# EasyEDA schematic SCH_CorvetteALDL_2024-03-12.json
TITLE: Corvette C4 ALDL; REV: 1.0; Date: 2023-11-16; Sheet: 1/1; Drawn By: cubus; Company: Cubus
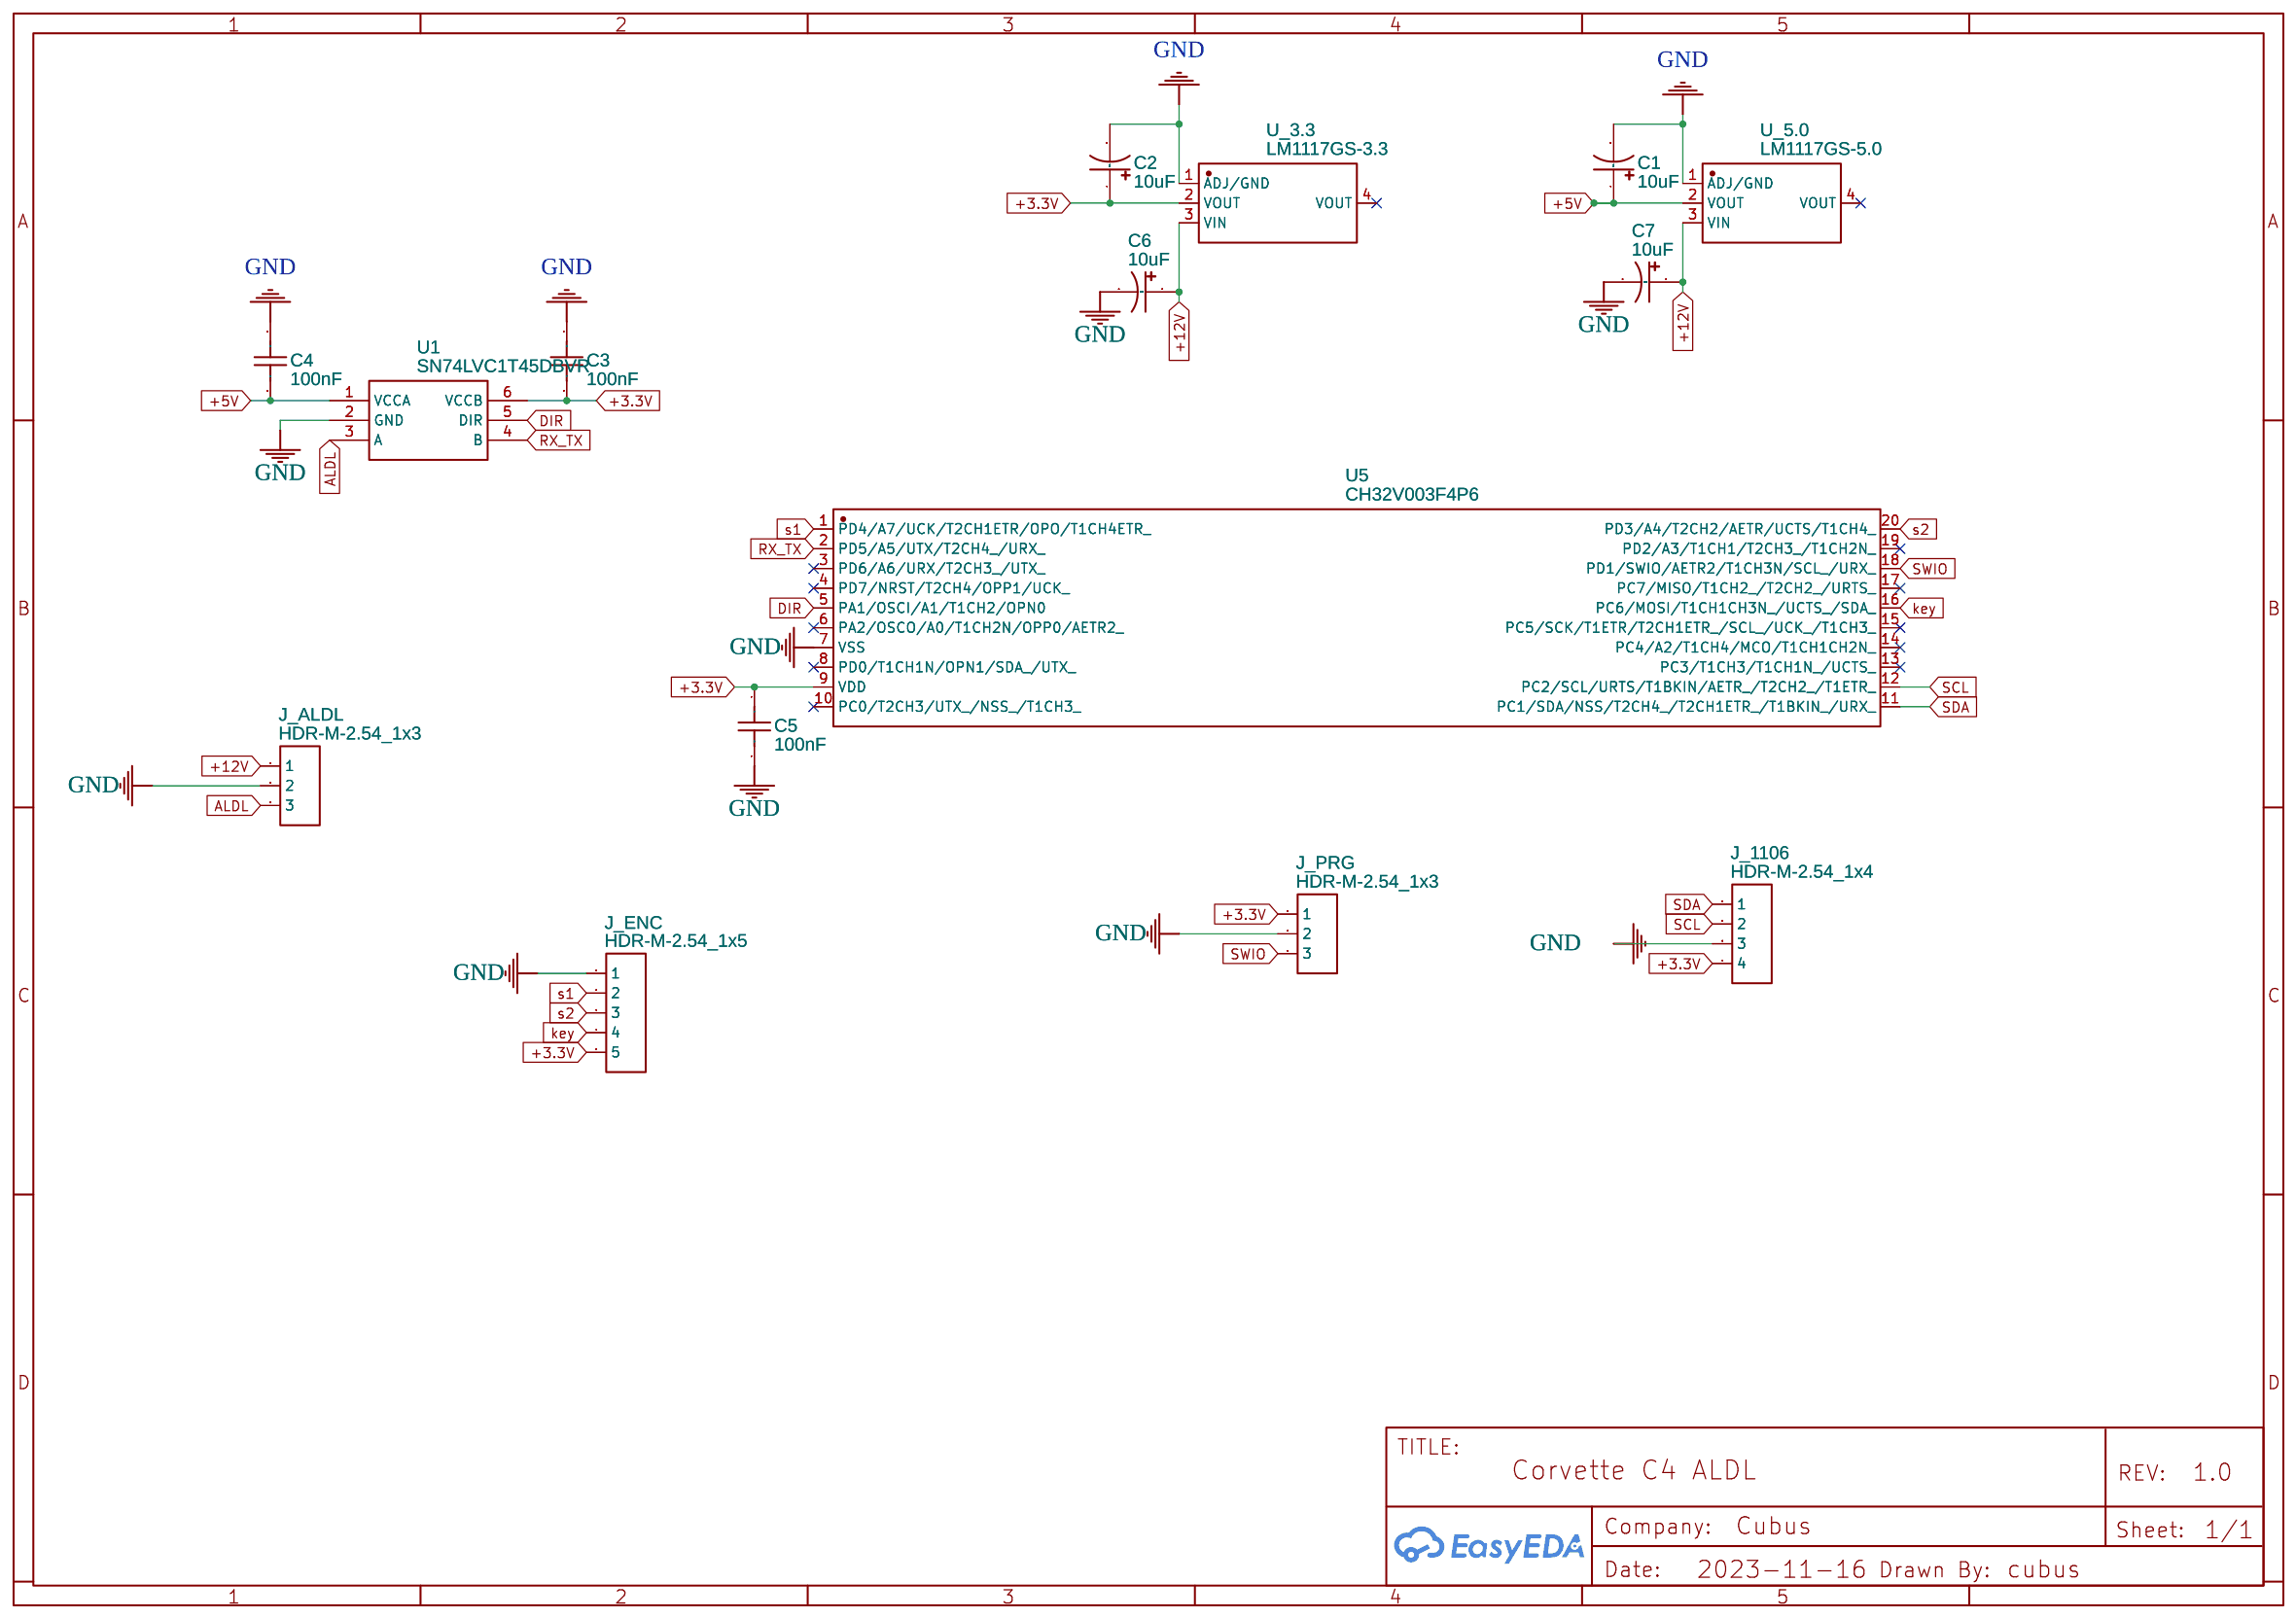
[diagram p0: schematic sheet]

## Parts
C1  10uF  [CASE-A_3216]
C2  10uF  [CASE-A_3216]
C3  100nF  [C1206]
C4  100nF  [C1206]
C5  100nF  [C1206]
C6  10uF  [CASE-A_3216]
C7  10uF  [CASE-A_3216]
J_1106  HDR-M-2.54_1x4  [HDR-M-2.54_1X4]
J_ALDL  HDR-M-2.54_1x3  [HDR-M-2.54_1X3]
J_ENC  HDR-M-2.54_1x5  [HDR-M-2.54_1X5]
J_PRG  HDR-M-2.54_1x3  [HDR-M-2.54_1X3]
U1  SN74LVC1T45DBVR  [SOT-23-6_L2.9-W1.6-P0.95-LS2.8-BR]
U5  CH32V003F4P6  [TSSOP-20_L6.5-W4.4-P0.65-LS6.4-BL]
U_3  LM1117GS-3.3  [SOT-223-3_L6.5-W3.4-P2.30-LS7.0-BR]  (section 3)
U_5  LM1117GS-5.0  [SOT-223-3_L6.5-W3.4-P2.30-LS7.0-BR]  (section 0)

## Library data of the parts
C1 C2 C6 C7 = TCA1A106M8R: Contributor: LCSC; Supplier: LCSC; Supplier Part: C184153; Manufacturer: ROHM(罗姆); JLCPCB Part Class: Extended Part; link: https://lcsc.com/eda_search?q=C184153&%26type=1&ref=editor
C3-C5 = C3216X7R2A104M160AA: Contributor: lcsc; Supplier: LCSC; Supplier Part: C3883507; Manufacturer: TDK; link: https://lcsc.com/eda_search?q=C3883507&%26type=1&ref=editor
J_1106 = HDR-M-2.54_1x4: Supplier Part: C124378; Supplier: LCSC; Contributor: LCEDA_Lib
J_ALDL J_PRG = HDR-M-2.54_1x3: Supplier Part: C180248; Supplier: LCSC; Contributor: LCEDA_Lib
J_ENC = HDR-M-2.54_1x5: Supplier Part: C358687; Supplier: LCSC; Contributor: LCEDA_Lib
U1 = SN74LVC1T45DBVR: Supplier: LCSC; Manufacturer: TI(德州仪器); Supplier Part: C7843; JLCPCB Part Class: Extended Part
U5 = CH32V003F4P6: Contributor: lcsc; Supplier: LCSC; Supplier Part: C5187096; Manufacturer: null; JLCPCB Part Class: Extended Part; link: https://lcsc.com/eda_search?q=C5187096&%26type=1&ref=editor
U_3 = LM1117GS-3.3: Contributor: LCSC; Supplier: LCSC; Supplier Part: C411821; Manufacturer: HTC; JLCPCB Part Class: Extended Part; link: https://lcsc.com/eda_search?q=C411821&%26type=1&ref=editor
U_5 = LM1117GS-5.0: Contributor: LCSC; Supplier: LCSC; Supplier Part: C465002; Manufacturer: HTC; JLCPCB Part Class: Extended Part; link: https://lcsc.com/eda_search?q=C465002&%26type=1&ref=editor

## Nets
+3.3V: C2.1 C3.2 C5.1 J_1106.4 J_ENC.5 J_PRG.1 U1.6(VCCB) U5.9(VDD) U_3.2(VOUT)
+5V: C1.1 C4.2 U1.1(VCCA) U_5.2(VOUT)
+12V: C6.1 C7.1 J_ALDL.1 U_3.3(VIN) U_5.3(VIN)
GND: C1.2 C2.2 C3.1 C4.1 C5.2 C6.2 C7.2 J_1106.3 J_ALDL.2 J_ENC.1 J_PRG.2 U1.2(GND) U5.7(VSS) U_3.1(ADJ/GND) U_5.1(ADJ/GND)
ALDL: J_ALDL.3 U1.3(A)
DIR: U1.5(DIR) U5.5(PA1/OSCI/A1/T1CH2/OPN0)
key: J_ENC.4 U5.16(PC6/MOSI/T1CH1CH3N_/UCTS_/SDA_)
RX_TX: U1.4(B) U5.2(PD5/A5/UTX/T2CH4_/URX_)
s1: J_ENC.2 U5.1(PD4/A7/UCK/T2CH1ETR/OPO/T1CH4ETR_)
s2: J_ENC.3 U5.20(PD3/A4/T2CH2/AETR/UCTS/T1CH4_)
SCL: J_1106.2 U5.12(PC2/SCL/URTS/T1BKIN/AETR_/T2CH2_/T1ETR_)
SDA: J_1106.1 U5.11(PC1/SDA/NSS/T2CH4_/T2CH1ETR_/T1BKIN_/URX_)
SWIO: J_PRG.3 U5.18(PD1/SWIO/AETR2/T1CH3N/SCL_/URX_)

Not connected (* = marked no-connect by the designer): U5 3(PD6/A6/URX/T2CH3_/UTX_)* 4(PD7/NRST/T2CH4/OPP1/UCK_)* 6(PA2/OSCO/A0/T1CH2N/OPP0/AETR2_)* 8(PD0/T1CH1N/OPN1/SDA_/UTX_)* 10(PC0/T2CH3/UTX_/NSS_/T1CH3_)* 13(PC3/T1CH3/T1CH1N_/UCTS_)* 14(PC4/A2/T1CH4/MCO/T1CH1CH2N_)* 15(PC5/SCK/T1ETR/T2CH1ETR_/SCL_/UCK_/T1CH3_)* 17(PC7/MISO/T1CH2_/T2CH2_/URTS_)* 19(PD2/A3/T1CH1/T2CH3_/T1CH2N_)*; U_3 4(VOUT)*; U_5 4(VOUT)*
